# Altium schematic sheet MCU 1.SchDoc
size 297 x 209 mm; SheetNumber: 4; SheetTotal: 29
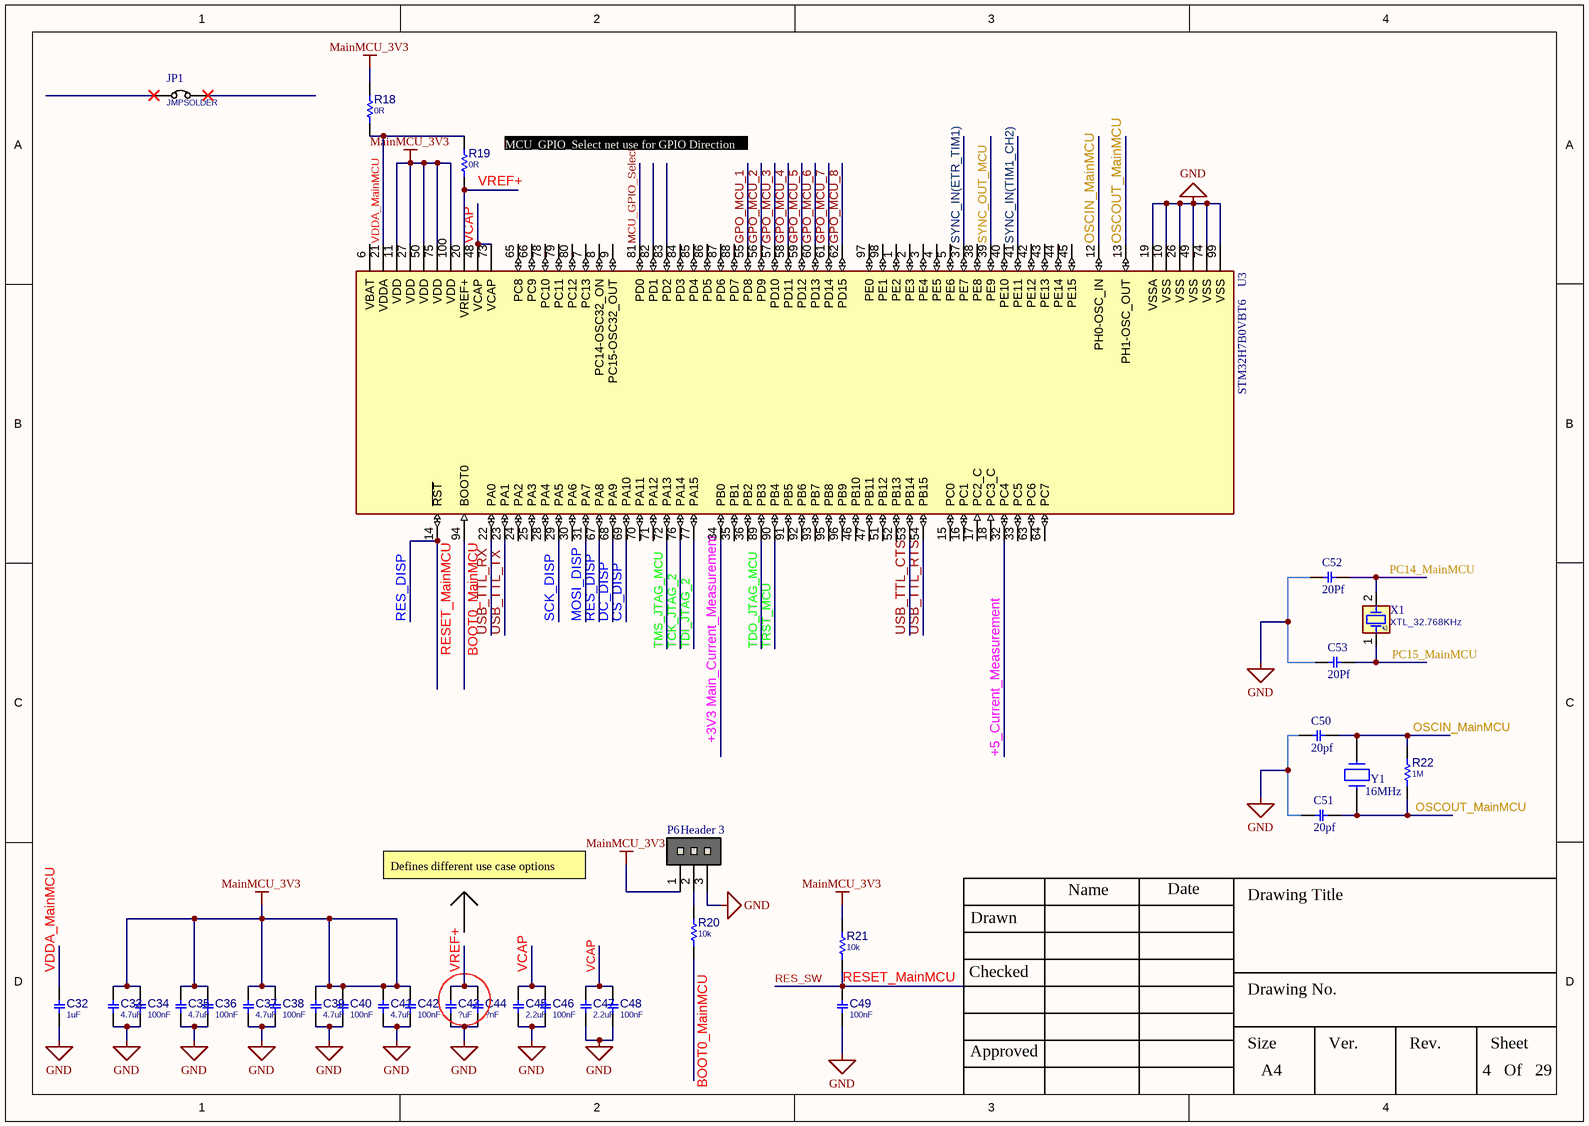
[diagram p0: MCU 1.SchDoc]

## Parts
C32  1uF  [C0805]
C33  4.7uF  [C0805]
C34  100nF  [C0603]
C35  4.7uF  [C0805]
C36  100nF  [C0603]
C37  4.7uF  [C0805]
C38  100nF  [C0603]
C39  4.7uF  [C0805]
C40  100nF  [C0603]
C41  4.7uF  [C0805]
C42  100nF  [C0603]
C43  ?uF  [C0805]
C44  ?nF  [C0603]
C45  2.2uF  [C0805]
C46  100nF  [C0603]
C47  2.2uF  [C0805]
C48  100nF  [C0603]
C49  100nF  [C0603]
C50  value 20pf  [C0603]  (hidden comment: Capacitor C SMD 0603)
C51  value 20pf  [C0603]  (hidden comment: Capacitor C SMD 0603)
C52  value 20Pf  [C0603]  (hidden comment: Capacitor C SMD 0603)
C53  value 20Pf  [C0603]  (hidden comment: Capacitor C SMD 0603)
JP1  JMPSOLDER  [JP_40X50]
P6  Header 3  [HDR 1X3]
R18  0R  [R0603]
R19  0R  [R0603]
R20  10k  [R0603]
R21  10k  [R0603]
R22  1M  [R0603]
U3  STM32H7B0VBT6  [QFP50P1600X1600X160-100N]
X1  XTL_32.768KHz  [XTL_2_2012]
Y1  16MHz  [XTL_2_11X5]

## Nets
GND: C32.2 C33.2 C34.2 C35.2 C36.2 C37.2 C38.2 C39.2 C40.2 C41.2 C42.2 C43.2 C44.2 C45.2 C46.2 C47.2 C48.2 C49.2 C50.1 C51.1 C52.1 C53.1 P6.3 U3.10(VSS) U3.19(VSSA) U3.26(VSS) U3.49(VSS) U3.74(VSS) U3.99(VSS)
MainMCU_3V3: C33.1 C34.1 C35.1 C36.1 C37.1 C38.1 C39.1 C40.1 C41.1 C42.1 P6.1 R18.2 R21.2 U3.11(VDD) U3.27(VDD) U3.50(VDD) U3.75(VDD) U3.100(VDD)
+3V3 Main_Current_Measurement: U3.34(PB0)
+5_Current_Measurement: U3.32(PC4)
BOOT0_MainMCU: R20.1 U3.94(BOOT0)
CS_DISP: U3.69(PA10)
DC_DISP: U3.68(PA9)
GPO_MCU_1: U3.55(PD8)
GPO_MCU_2: U3.56(PD9)
GPO_MCU_3: U3.57(PD10)
GPO_MCU_4: U3.58(PD11)
GPO_MCU_5: U3.59(PD12)
GPO_MCU_6: U3.60(PD13)
GPO_MCU_7: U3.61(PD14)
GPO_MCU_8: U3.62(PD15)
MCU_GPIO_Select: U3.81(PD0)
MOSI_DISP: U3.31(PA7)
OSCIN_MainMCU: C50.2 R22.2 U3.12(PH0-OSC_IN) Y1.2
OSCOUT_MainMCU: C51.2 R22.1 U3.13(PH1-OSC_OUT) Y1.1
PC14_MainMCU: C52.2 X1.2(OSC2)
PC15_MainMCU: C53.2 X1.1(OSC1)
RES_DISP: C49.1 R21.1 U3.14(~{RST}) U3.67(PA8)  [also labelled RES_SW, RESET_MainMCU]
SCK_DISP: U3.29(PA5)
SYNC_IN(ETR_TIM1): U3.37(PE7)
SYNC_IN(TIM1_CH2): U3.41(PE11)
SYNC_OUT_MCU: U3.39(PE9)
~{TRST}_MCU: U3.90(PB4)
TCK_JTAG_2: U3.76(PA14)
TDI_JTAG_2: U3.77(PA15)
TDO_JTAG_MCU: U3.89(PB3)
TMS_JTAG_MCU: U3.72(PA13)
USB_TTL_CTS: U3.53(PB14)
USB_TTL_RTS: U3.54(PB15)
USB_TTL_RX: U3.22(PA0)
USB_TTL_TX: U3.23(PA1)
VCAP: C45.1 C46.1 C47.1 C48.1 U3.48(VCAP) U3.73(VCAP)
VDDA_MainMCU: C32.1 R18.1 R19.2 U3.21(VDDA)
VREF+: C43.1 C44.1 R19.1 U3.20(VREF+)
NetP6_2: P6.2 R20.2

Not connected (* = marked no-connect by the designer): JP1 1* 2*; U3 1(PE2) 2(PE3) 3(PE4) 4(PE5) 5(PE6) 6(VBAT) 7(PC13) 8(PC14-OSC32_ON) 9(PC15-OSC32_OUT) 15(PC0) 16(PC1) 17(PC2_C) 18(PC3_C) 24(PA2) 25(PA3) 28(PA4) 30(PA6) 33(PC5) 35(PB1) 36(PB2) 38(PE8) 40(PE10) 42(PE12) 43(PE13) 44(PE14) 45(PE15) 46(PB10) 47(PB11) 51(PB12) 52(PB13) 63(PC6) 64(PC7) 65(PC8) 66(PC9) 70(PA11) 71(PA12) 78(PC10) 79(PC11) 80(PC12) 82(PD1) 83(PD2) 84(PD3) 85(PD4) 86(PD5) 87(PD6) 88(PD7) 91(PB5) 92(PB6) 93(PB7) 95(PB8) 96(PB9) 97(PE0) 98(PE1)

## Notes on the sheet
- (near R19) MCU_GPIO_Select net use for GPIO Direction
- Defines different use case options
- Drawn
- Name
- Date
- Drawing Title
- Checked
- Drawing No.
- Approved
- Size
- A4
- Ver.
- Rev.
- Sheet
- Of

## Library data of the parts
C32 C33 C35 C37 C39 C41 C43 C45 C47 = CAP_SMD_MLCC_2.2u50V_0805: CAP, MLCC; MANF_P#: UMK212ABJ225KG-T; MANF: Taiyo Yuden; PARAM: X5R, 10%; DIST#: MOUSER; PARAM2: 50V; ASSEMBLY: ASSEMBLY; PRICE: 100= 10$; DESC: CAP, MLCC
  C32: VALUE: 1uF
  C33 C35 C37 C39 C41: VALUE: 4.7uF
  C43: VALUE: ?uF
  C45 C47: VALUE: 2.2uF
C34 C36 C38 C40 C42 C44 C46 C48 C49 = CAP_SMD_MLCC_2.2u50V_0603: CAP, MLCC; MANF_P#: C1005X7R1H104K050BB; MANF: TDK; PARAM: X7R, 10%; DIST#: MOUSER; PARAM2: 50V; ASSEMBLY: ASSEMBLY; PRICE: 1000= 27$; DESC: CAP, MLCC
  C34 C36 C38 C40 C42 C46 C48 C49: VALUE: 100nF
  C44: VALUE: ?nF
JP1 = JUMPER_SOLDER: JUMPER, HEADER 2PIN; MANF: MANF; MANF_P#: MANF_P#; VALUE: JMPSOLDER
P6 = Header 3: Header, 3-Pin; ComponentLinkp-URL: https://www.smartw.ir/; DatasheetVersion: 2020
R18-R21 = RES_SMD_0603: RESISTOR, SMD; PARAM: -W; DESC: DESCRIPTION; DIST#: MOUSER; PARAM2: 1%; MANF_P#: -; MANF: -; ASSEMBLY: ASSEMBLY; PRICE: 100= 0.5$
  R18 R19: VALUE: 0R
  R20 R21: VALUE: 10k
R22 = RES_SMD: RESISTOR, SMD; PARAM: -W; DESC: DESCRIPTION; DIST#: MOUSER; PARAM2: 1%; MANF_P#: -; MANF: -; ASSEMBLY: ASSEMBLY; PRICE: 100= 0.5$; VALUE: 1M
U3 = STM32H7B0VBT6: ARMÂ® CortexÂ®-M7 STM32H7 Microcontroller IC 32-Bit Single-Core 280MHz 128KB (128K x 8) FLASH 100-LQFP (14x14); MF: STMicroelectronics; Availability: In Stock; Purchase-URL: https://pricing.snapeda.com/search/part/STM32H7B0VBT6/?ref=eda; SnapEDA_Link: https://www.snapeda.com/parts/STM32H7B0VBT6/STMicroelectronics/view-part/?ref=snap; MP: STM32H7B0VBT6; Price: None; Value: *; Check_prices: https://www.snapeda.com/parts/STM32H7B0VBT6/STMicroelectronics/view-part/?ref=eda; Package: LQFP-100 STMicroelectronics
X1 = XTL_2_32.768_2012EP: Crystal, 32.768KHz, 12pF, 20PPM; MANF: EPSON; MANF_P#: FC-12M 32.7680KA-A3; PARAM: -40~85oC; PARAM2: 12pF, 20PPM; PRICE: 0.8$; VALUE: XTL_32.768KHz
Y1 = Crystal: ComponentLink1Description: Website Smart World; ComponentLink1URL: https://www.smartw.ir/; ComponentLink2Description: Telegram; ComponentLink2URL: https://t.me/altium_smartw; ComponentLink3Description: Instagram; ComponentLink3URL: https://Instagram.com/smartgw.ir; DatasheetVersion: 2021
C50-C53 = Capacitor C SMD 0603: DatasheetVersion: 2021; ComponentLink1Description: Website Smart World; ComponentLink1URL: https://www.smartw.ir/; ComponentLink2Description: Telegram; ComponentLink2URL: https://t.me/altium_smartw; ComponentLink3Description: Instagram; ComponentLink3URL: https://Instagram.com/smartgw.ir